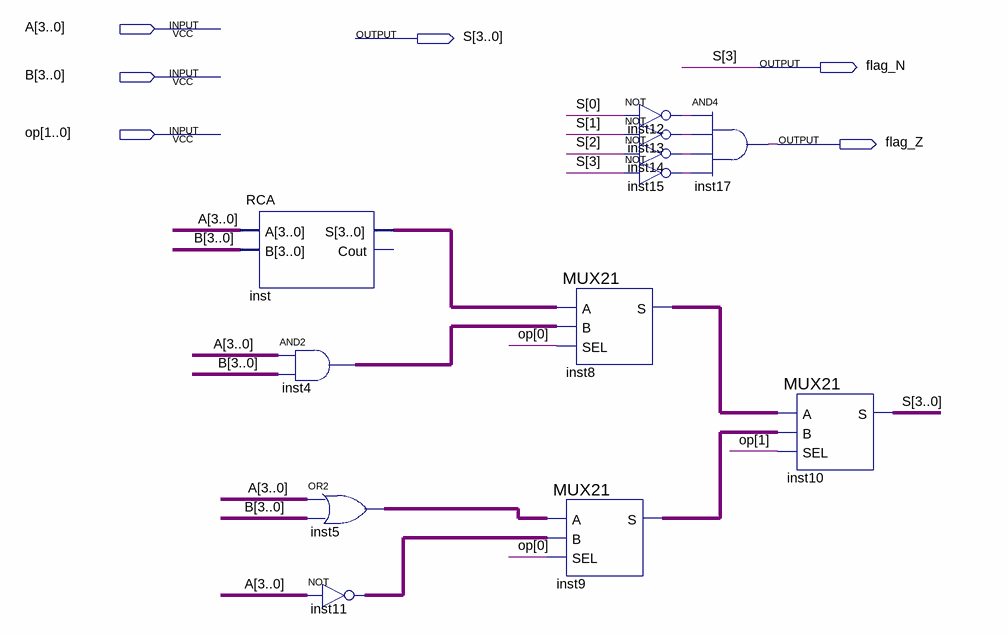
[diagram p0: schematic sheet]
// Quartus schematic ULA.bdf as structural Verilog: 12 symbols, 6 pins
module ULA (
  input  [3:0] A,
  input  [3:0] B,
  input  [1:0] op,
  output [3:0] S,
  output flag_N,
  output flag_Z
);

  wire inst8_s, inst9_s, inst12_out, inst13_out, inst14_out, inst15_out;
  wire [3:0] inst4_out, inst5_out, inst11_out, inst_s;

  RCA inst (.A(A), .B(B), .S(inst_s));  // open: Cout
  assign inst4_out = A & B;  // AND2 inst4, 4 bits wide
  assign inst5_out = A | B;  // OR2 inst5, 4 bits wide
  assign inst11_out = ~A;  // NOT inst11, 4 bits wide
  MUX21 inst8 (.A(inst_s), .B(inst4_out), .SEL(op[0]), .S(inst8_s));
  MUX21 inst9 (.A(inst5_out), .B(inst11_out), .SEL(op[0]), .S(inst9_s));
  not inst12 (inst12_out, S[0]);
  not inst13 (inst13_out, S[1]);
  not inst14 (inst14_out, S[2]);
  not inst15 (inst15_out, flag_N);
  and inst17 (flag_Z, inst12_out, inst13_out, inst14_out, inst15_out);
  MUX21 inst10 (.A(inst8_s), .B(inst9_s), .SEL(op[1]), .S({flag_N, S[2:0]}));

  assign S[3] = flag_N;
endmodule
